# Altium schematic sheet rectifier.SchDoc
size A
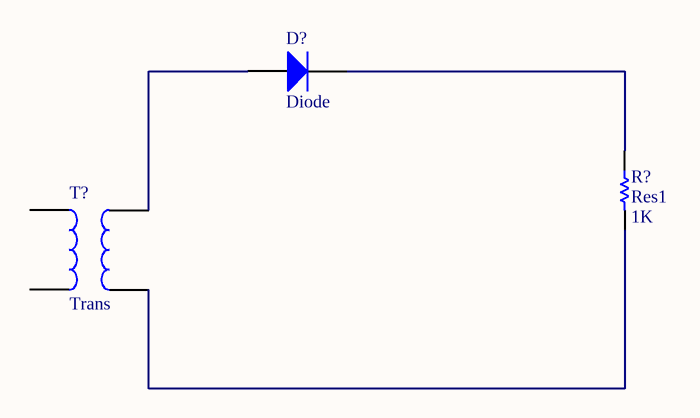
[diagram p0: rectifier.SchDoc]

## Parts
D?  Diode  [SMC]
R?  Res1  value 1K  [AXIAL-0.3]
T?  Trans  [TRANS]

## Nets
NetD?_1: D?.1(A) T?.3
NetD?_2: D?.2(K) R?.1
NetR?_2: R?.2 T?.4

Not connected (* = marked no-connect by the designer): T? 1 2

## Library data of the parts
D? = Diode: Default Diode; Published: 8-Jun-2000; LatestRevisionDate: 17-Jul-2002; LatestRevisionNote: Re-released for DXP Platform.; PackageVersion: Sep-1996; PackageReference: SMC; Publisher: Altium Limited; PackageDescription: DO-214-AB/SMC; 2 C-Bend Leads; Body 7.9 x 5.9 mm, inc. leads (LxW); Code_JEDEC: DO-214-AB
R? = Res1: Resistor; Published: 8-Jun-2000; LatestRevisionDate: 17-Jul-2002; LatestRevisionNote: Re-released for DXP Platform.; PackageReference: AXIAL-0.3; Publisher: Altium Limited; PackageDescription: Axial Device, Thru-Hole; 2 Leads; 0.3 in Pin Spacing
T? = Trans: Transformer; Published: 24-Mar-1999; LatestRevisionDate: 08-Jul-2005; LatestRevisionNote: Mech Layer 1 removed.; PackageReference: TRANS; Publisher: Altium Limited; PackageDescription: Transformer; 4 Leads